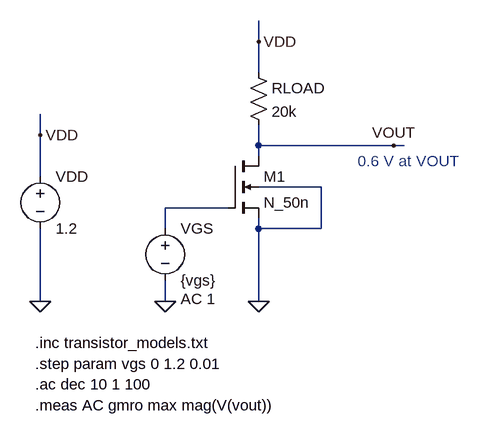
[diagram p0: schematic lab06_cs_amp_ac_extract.asc]
lab06_cs_amp_ac_extract.asc, the LTspice schematic file:
Version 4
SHEET 1 880 680
WIRE 160 -128 160 -160
WIRE 160 -80 160 -128
WIRE -176 16 -176 -16
WIRE 160 32 160 0
WIRE 368 32 160 32
WIRE 384 32 368 32
WIRE 160 48 160 32
WIRE -176 80 -176 16
WIRE 256 96 160 96
WIRE 112 128 16 128
WIRE 16 160 16 128
WIRE 160 160 160 144
WIRE 256 160 256 96
WIRE 256 160 160 160
WIRE -176 272 -176 160
WIRE 16 272 16 240
WIRE 160 272 160 160
FLAG 160 272 0
FLAG 16 272 0
FLAG -176 272 0
FLAG -176 16 VDD
FLAG 160 -128 VDD
FLAG 368 32 VOUT
SYMBOL nmos4 112 48 R0
SYMATTR InstName M1
SYMATTR Value N_50n
SYMATTR Value2 l=1u w=10u
SYMBOL voltage 16 144 R0
WINDOW 123 24 124 Left 2
WINDOW 39 0 0 Left 0
SYMATTR Value2 AC 1
SYMATTR InstName VGS
SYMATTR Value {vgs}
SYMBOL voltage -176 64 R0
WINDOW 123 0 0 Left 0
WINDOW 39 0 0 Left 0
SYMATTR InstName VDD
SYMATTR Value 1.2
SYMBOL res 144 -96 R0
SYMATTR InstName RLOAD
SYMATTR Value 20k
TEXT -184 336 Left 2 !.inc transistor_models.txt
TEXT 312 56 Left 2 ;0.6 V at VOUT
TEXT -184 368 Left 2 !.step param vgs 0 1.2 0.01
TEXT -184 432 Left 2 !.meas AC gmro max mag(V(vout))
TEXT -184 400 Left 2 !.ac dec 10 1 100

The netlist it stands for:
* lab06_cs_amp_ac_extract.asc
M1 VOUT N001 0 0 N_50n l=1u w=10u
VGS N001 0 {vgs} AC 1
VDD VDD 0 1.2
RLOAD VDD VOUT 20k
.model NMOS NMOS
.model PMOS PMOS
.lib standard.mos
.inc transistor_models.txt
* 0.6 V at VOUT
.step param vgs 0 1.2 0.01
.meas AC gmro max mag(V(vout))
.ac dec 10 1 100
.backanno
.end

* Results of the author's LTspice run, read from the files saved beside the schematic
* Operating Point (first step), zero values left out:
*   V(vout) = 1.199 V
*   V(vdd) = 1.2 V
*   Id(M1) = 73.28 nA
*   Ig(M1) = -32.13 nA
*   Ib(M1) = -47.65 pA
*   Is(M1) = -41.1 nA
*   I(Rload) = 73.28 nA
*   I(Vdd) = -73.28 nA
*   I(Vgs) = 32.13 nA
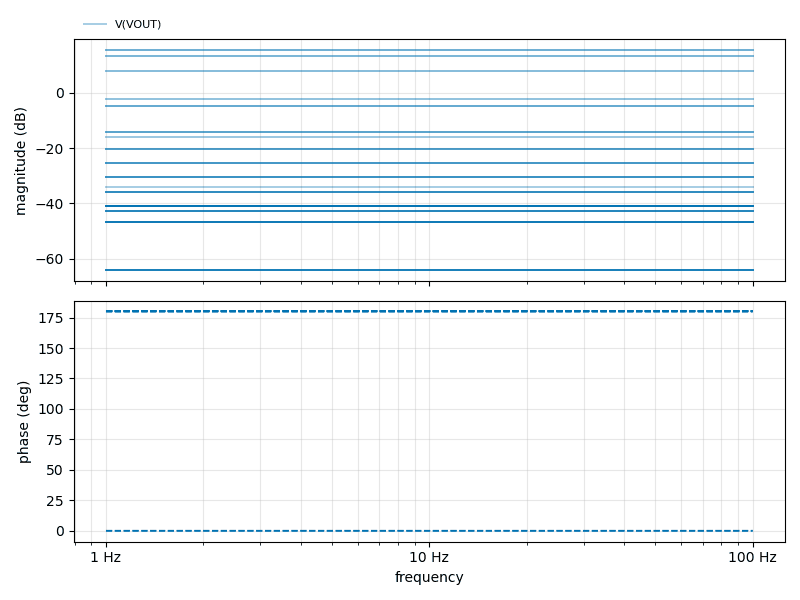
[diagram p1: AC Analysis of lab06_cs_amp_ac_extract.asc, plotted from the saved traces]
* AC Analysis, 121 runs:
*   V(VOUT) [run 1]: -34.04 dB at 1 Hz, -34.04 dB at 100 Hz, peak -34.04 dB at 100 Hz
*   V(VOUT) [run 2]: -16.05 dB at 1 Hz, -16.05 dB at 100 Hz, peak -16.05 dB at 100 Hz
*   V(VOUT) [run 3]: -2.43 dB at 1 Hz, -2.43 dB at 100 Hz, peak -2.43 dB at 1 Hz
*   V(VOUT) [run 4]: 7.69 dB at 1 Hz, 7.69 dB at 100 Hz, peak 7.69 dB at 1 Hz
*   V(VOUT) [run 5]: 13.44 dB at 1 Hz, 13.44 dB at 100 Hz, peak 13.44 dB at 1 Hz
*   V(VOUT) [run 6]: 15.31 dB at 1 Hz, 15.31 dB at 100 Hz, peak 15.31 dB at 7.943 Hz
*   V(VOUT) [run 7]: -4.79 dB at 1 Hz, -4.79 dB at 100 Hz, peak -4.79 dB at 100 Hz
*   V(VOUT) [run 8]: -14.18 dB at 1 Hz, -14.18 dB at 100 Hz, peak -14.18 dB at 100 Hz
* From the log:
*   Measurement: gmro
*     step  MAX(mag(v(vout)))  FROM  TO
*        1  (-34.0361dB,0°)  1  100
*        2  (-31.4077dB,0°)  1  100
*        3  (-28.9305dB,0°)  1  100
*        4  (-26.5714dB,0°)  1  100
*        5  (-24.3106dB,0°)  1  100
*        6  (-22.1354dB,0°)  1  100
*        7  (-20.0373dB,0°)  1  100
*        8  (-18.0105dB,0°)  1  100
*        9  (-16.0504dB,0°)  1  100
*       10  (-14.1536dB,0°)  1  100
*       11  (-12.3168dB,0°)  1  100
*       12  (-10.5372dB,0°)  1  100
*       13  (-8.81256dB,0°)  1  100
*       14  (-7.14074dB,0°)  1  100
*       15  (-5.52027dB,0°)  1  100
*       16  (-3.9503dB,0°)  1  100
*       17  (-2.43074dB,0°)  1  100
*       18  (-0.962281dB,0°)  1  100
*       19  (0.453586dB,0°)  1  100
*       20  (1.81465dB,0°)  1  100
*       21  (3.11811dB,0°)  1  100
*       22  (4.36083dB,0°)  1  100
*       23  (5.53953dB,0°)  1  100
*       24  (6.65109dB,0°)  1  100
*       25  (7.69281dB,0°)  1  100
*       26  (8.66261dB,0°)  1  100
*       27  (9.55921dB,0°)  1  100
*       28  (10.3823dB,0°)  1  100
*       29  (11.1323dB,0°)  1  100
*       30  (11.8109dB,0°)  1  100
*       31  (12.4202dB,0°)  1  100
*       32  (12.9634dB,0°)  1  100
*       33  (13.4437dB,0°)  1  100
*       34  (13.8651dB,0°)  1  100
*       35  (14.2315dB,0°)  1  100
*       36  (14.5426dB,0°)  1  100
*       37  (14.8035dB,0°)  1  100
*       38  (15.0186dB,0°)  1  100
*       39  (15.187dB,0°)  1  100
*       40  (15.2989dB,0°)  1  100
*     ...